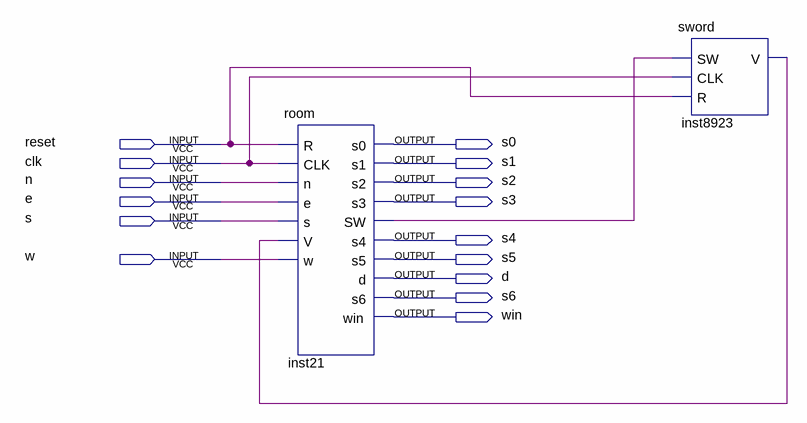
[diagram p0: schematic sheet]
// Quartus schematic adventure_game.bdf as structural Verilog: 2 symbols, 15 pins
module adventure_game (
  input  reset,
  input  clk,
  input  n,
  input  e,
  input  s,
  input  w,
  output s0,
  output s1,
  output s2,
  output s3,
  output s4,
  output s5,
  output d,
  output s6,
  output win
);

  wire inst21_sw, inst8923_v;

  room inst21 (
    .R(reset), .CLK(clk), .n(n), .e(e), .s(s), .V(inst8923_v), .w(w), .s0(s0), .s1(s1), .s2(s2), .s3(s3),
    .SW(inst21_sw), .s4(s4), .s5(s5), .d(d), .s6(s6), .win(win));
  sword inst8923 (.SW(inst21_sw), .CLK(clk), .R(reset), .V(inst8923_v));
endmodule
